# Altium schematic sheet 08_AUDIO.SchDoc
size 297 x 209 mm
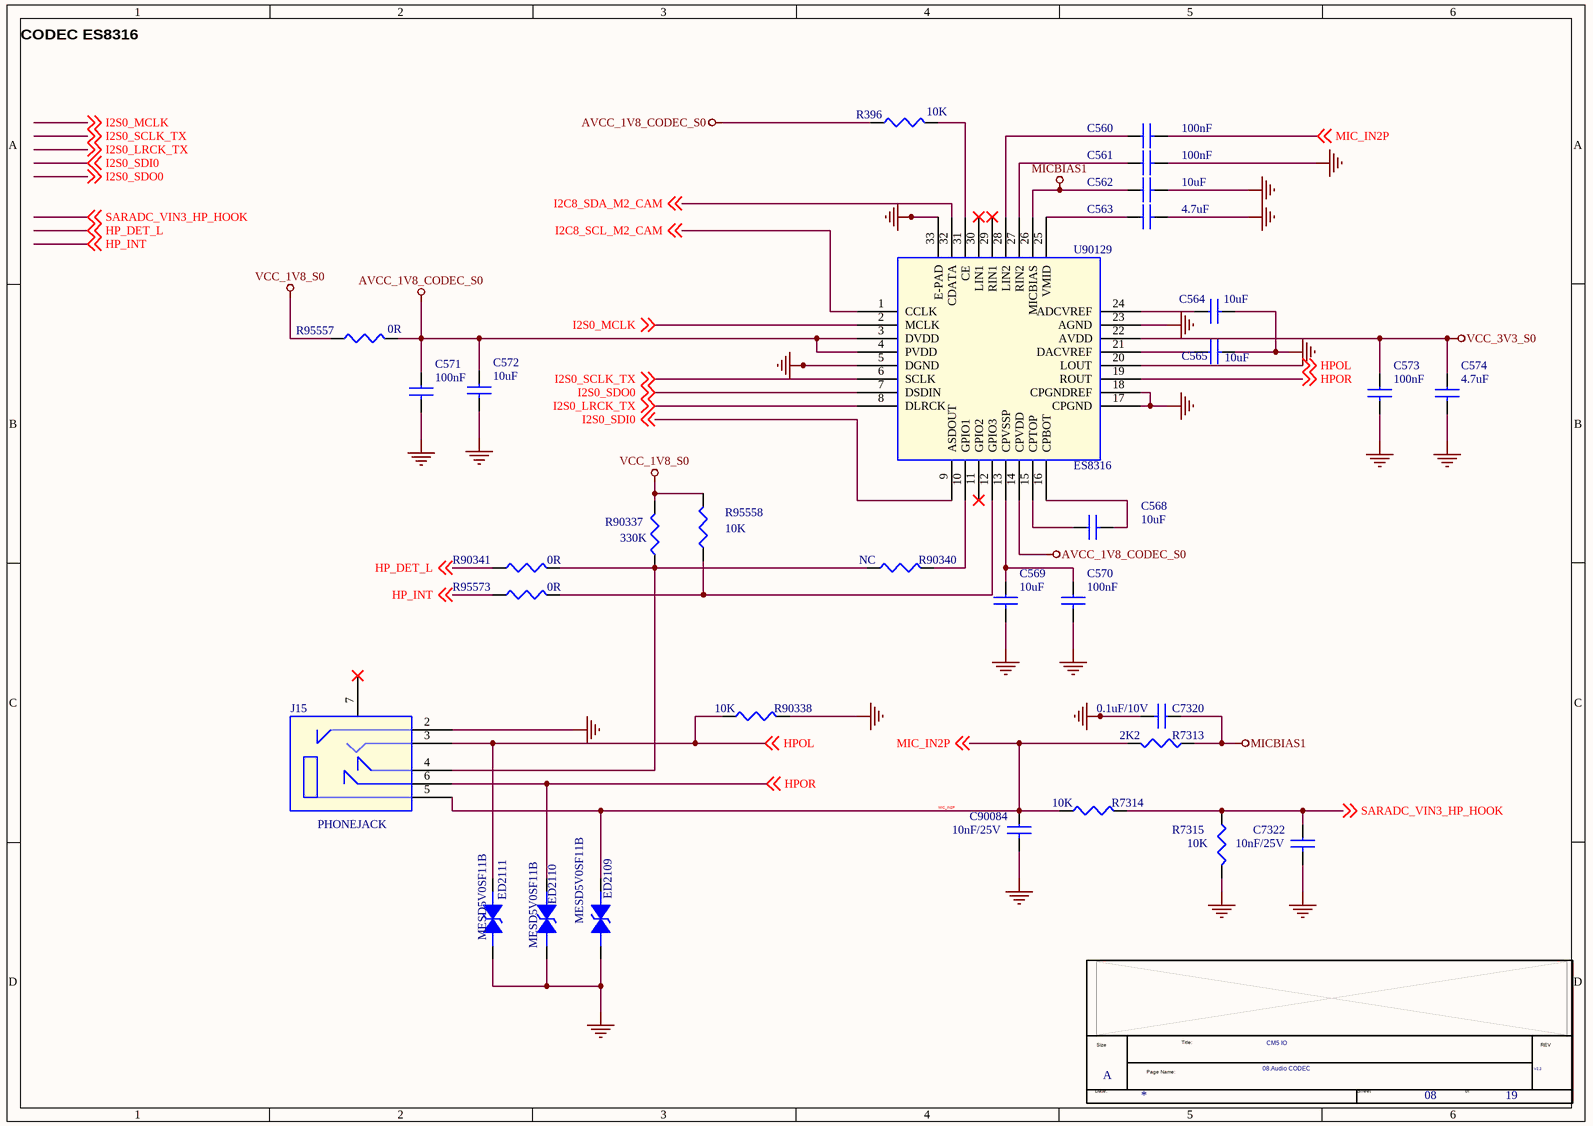
[diagram p0: 08_AUDIO.SchDoc]

## Parts
*  Doc: 08.Audio CODEC  RevCode: V2.2  Title: CM5 IO  Page Size: A  Page Number: 08  Page Count: 19  (hidden comment: radxa_1010)  (graphical)
C560  100nF  [C0402]
C561  100nF  [C0402]
C562  10uF  [C0603]
C563  4.7uF  [C0402]
C564  10uF  [C0603]
C565  10uF  [C0603]
C568  10uF  [C0603]
C569  10uF  [C0603]
C570  100nF  [C0402]
C571  100nF  [C0402]
C572  10uF  [C0603]
C573  100nF  [C0402]
C574  4.7uF  [C0402]
C7320  0.1uF/10V  [C0402]
C7322  10nF/25V  [C0402]
C90084  10nF/25V  [C0201]
ED2109  MESD5V0SF11B  [E0402N]
ED2110  MESD5V0SF11B  [E0402N]
ED2111  MESD5V0SF11B  [E0402N]
J15  PHONEJACK  [PJ-327A]
R396  10K  [R0402]
R7313  2K2  [R0402]
R7314  10K  [R0402]
R7315  10K  [R0402]
R90337  330K  [R0201]
R90338  10K  [R0201]
R90340  NC  [R0201]
R90341  0R  [R0201]
R95557  0R  [R0402]
R95558  10K  [R0201]
R95573  0R  [R0201]
U90129  ES8316  [QFN32P4X4]

## Nets
AVCC_1V8_CODEC_S0: C571.1 C572.1 R396.1 R95557.2 U90129.3(DVDD) U90129.4(PVDD) U90129.14(CPVDD)
GND: C561.2 C562.2 C563.2 C564.2 C565.2 C569.2 C570.2 C571.2 C572.2 C573.2 C574.2 C7320.2 C7322.2 C90084.2 ED2109.2 ED2110.2 ED2111.2 J15.2(DH) R7315.1 R90338.1 U90129.5(DGND) U90129.17(CPGND) U90129.18(CPGNDREF) U90129.23(AGND) U90129.33(E-PAD)
MICBIAS1: C562.1 C7320.1 R7313.2 U90129.26(MICBIAS)
VCC_1V8_S0: R90337.1 R95557.1 R95558.1
VCC_3V3_S0: C573.1 C574.1 U90129.22(AVDD)
HP_DET_L: R90341.2 ; off-sheet HP_DET_L
HP_INT: R95573.2 ; off-sheet HP_INT
HPOL: ED2111.1 J15.3(R) R90338.2 U90129.20(LOUT) ; off-sheet HPOL
HPOR: ED2110.1 J15.6(HP) U90129.19(ROUT) ; off-sheet HPOR
I2C8_SCL_M2_CAM: U90129.1(CCLK) ; off-sheet I2C8_SCL_M2_CAM
I2C8_SDA_M2_CAM: U90129.32(CDATA) ; off-sheet I2C8_SDA_M2_CAM
I2S0_LRCK_TX: U90129.8(DLRCK) ; off-sheet I2S0_LRCK_TX
I2S0_MCLK: U90129.2(MCLK) ; off-sheet I2S0_MCLK
I2S0_SCLK_TX: U90129.6(SCLK) ; off-sheet I2S0_SCLK_TX
I2S0_SDI0: U90129.9(ASDOUT) ; off-sheet I2S0_SDI0
I2S0_SDO0: U90129.7(DSDIN) ; off-sheet I2S0_SDO0
MIC_IN2P: C560.2 C90084.1 ED2109.1 J15.5(D) R7313.1 R7314.2 ; off-sheet MIC_IN2P
SARADC_VIN3_HP_HOOK: C7322.1 R7314.1 R7315.2 ; off-sheet SARADC_VIN3_HP_HOOK
NetC560_1: C560.1 U90129.28(LIN2)
NetC561_1: C561.1 U90129.27(RIN2)
NetC563_1: C563.1 U90129.25(VMID)
NetC564_1: C564.1 U90129.24(ADCVREF)
NetC565_1: C565.1 U90129.21(DACVREF)
NetC568_1: C568.1 U90129.15(CPTOP)
NetC568_2: C568.2 U90129.16(CPBOT)
NetC569_1: C569.1 C570.1 U90129.13(CPVSSP)
NetJ15_4: J15.4(L) R90337.2 R90340.2 R90341.1
NetR396_2: R396.2 U90129.31(CE)
NetR90340_1: R90340.1 U90129.10(GPIO1)
NetR95558_2: R95558.2 R95573.1 U90129.12(GPIO3)

Not connected (* = marked no-connect by the designer): J15 7(NC2)*; U90129 11(GPIO2)* 29(RIN1)* 30(LIN1)*

## Notes on the sheet
- CODEC ES8316
- (in symbol radxa_1010) Size; Title:; REV; Page Name:; Date:; Sheet; of

## Library data of the parts
C560 C570 C571 C573 = CAP NP_0_Dup2: cap,100.00nF,+/-10%,16V,X5R,C0402; Manufacturer PN: C1005X5R1C104K050BA; Manufacturer: TDK; Tolerance: 10%; Priority: A; Voltage: 16V; PCB Footprint: C0402; Dielectric: X5R; Created by: JJJ; Part Type: C0402; RK PN: C1005X5R1C104K050BA
C561 = CAP NP_0_Dup2: cap,100.00nF,+/-10%,16V,X5R,C0402; Manufacturer: TDK; RK PN: C1005X5R1C104K050BA; Priority: A; Tolerance: 10%; Voltage: 16V; PCB Footprint: C0402; Dielectric: X5R; Part Type: C0402; Manufacturer PN: C1005X5R1C104K050BA; Created by: JJJ
C562 C564 C565 C572 = CAP NP_0_Dup2: cap,10.00uF,+/-10%,10V,X5R,C0805; Manufacturer PN: C2012X5R1A106K125AB; Manufacturer: TDK; Tolerance: 10%; Priority: A; Voltage: 10V; PCB Footprint: C0603; Dielectric: X5R; Created by: JJJ; Part Type: C0805; RK PN: C2012X5R1A106K125AB
C563 = CAP NP_0_Dup2: cap,4.70uF,+/-10%,10V,X5R,C0603; Manufacturer PN: C1608X5R1A475K080AC; Manufacturer: TDK; Tolerance: 10%; Priority: A; Voltage: 10V; PCB Footprint: C0402; Dielectric: X5R; Created by: JJJ; Part Type: C0603; RK PN: C1608X5R1A475K080AC
C568 C569 = CAP NP_0_Dup2: cap,10.00uF,+/-10%,10V,X5R,C0805; Manufacturer: TDK; RK PN: C2012X5R1A106K125AB; Priority: A; Tolerance: 10%; Voltage: 10V; PCB Footprint: C0603; Dielectric: X5R; Part Type: C0805; Manufacturer PN: C2012X5R1A106K125AB; Created by: JJJ
C574 = CAP NP_0_Dup2: cap,4.70uF,+/-10%,10V,X5R,C0603; Manufacturer: TDK; RK PN: C1608X5R1A475K080AC; Priority: A; Tolerance: 10%; Voltage: 10V; PCB Footprint: C0402; Dielectric: X5R; Part Type: C0603; Manufacturer PN: C1608X5R1A475K080AC; Created by: JJJ
C7320 = CAP: RoHS CHIP CAP 0.1uF +10/-10% X7R; PCB Footprint: C0402
C7322 C90084 = CAP: RoHS CHIP CAP 0.01uF +10/-10% X7R
  C7322: PCB Footprint: C0402
  C90084: PCB Footprint: C0201
ED2109 = TVS: ESD Component,5V,30P,SMD,0402; BOM_TYPE: 40; BOM_VALUE: 0; PCB Footprint: E0402N
ED2110 ED2111 = TVS: ESD Component,5V,30P,SMD,0402; BOM_VALUE: 0; BOM_TYPE: 40; PCB Footprint: E0402N
J15 = PHONEJACK STEREO SW_0: 耳插; BOM_VALUE: 0; BOM_TYPE: 60; PCB Footprint: PJ-327A
R396 = RESISTOR_1_Dup1: 通用厚膜电阻,33R,+/-5%,R0402,1/16W.; Manufacturer: YAGEO; Tolerance: 5%; RK PN: RC0402JR-0733RL; Priority: A; Wattage: 1/16W; PCB Footprint: R0402; Part Type: 通用厚膜电阻; Manufacturer PN: RC0402JR-0733RL; Created by: YTL
R7313 = RESISTOR: ROHS CHIP RES 2K2 1/16W 5%; PCB Footprint: R0402
R7314 R7315 R90337 R90338 R90340 R90341 R95558 R95573 = RESISTOR: ROHS CHIP RES 0R 1/16W 5%
  R7314 R7315: PCB Footprint: R0402
  R90337 R90338 R90340 R90341 R95558 R95573: PCB Footprint: R0201
R95557 = RESISTOR_1_Dup1: 通用厚膜电阻,33R,+/-5%,R0402,1/16W.; Manufacturer PN: RC0402JR-0733RL; Manufacturer: YAGEO; Tolerance: 5%; Wattage: 1/16W; Priority: A; PCB Footprint: R0402; Created by: YTL; Part Type: 通用厚膜电阻; RK PN: RC0402JR-0733RL
U90129 = CODEC_ES8316: Low Power Audio CODEC; Manufacturer: Everest（顺芯）; Priority: A; PCB Footprint: QFN32P4X4; RK PN: ES8316; Part Type: Codec; Manufacturer PN: ES8316; Created by: JJJ
* = radxa_1010: Page Create Date: March  8, 1995; Page Modify Date: *